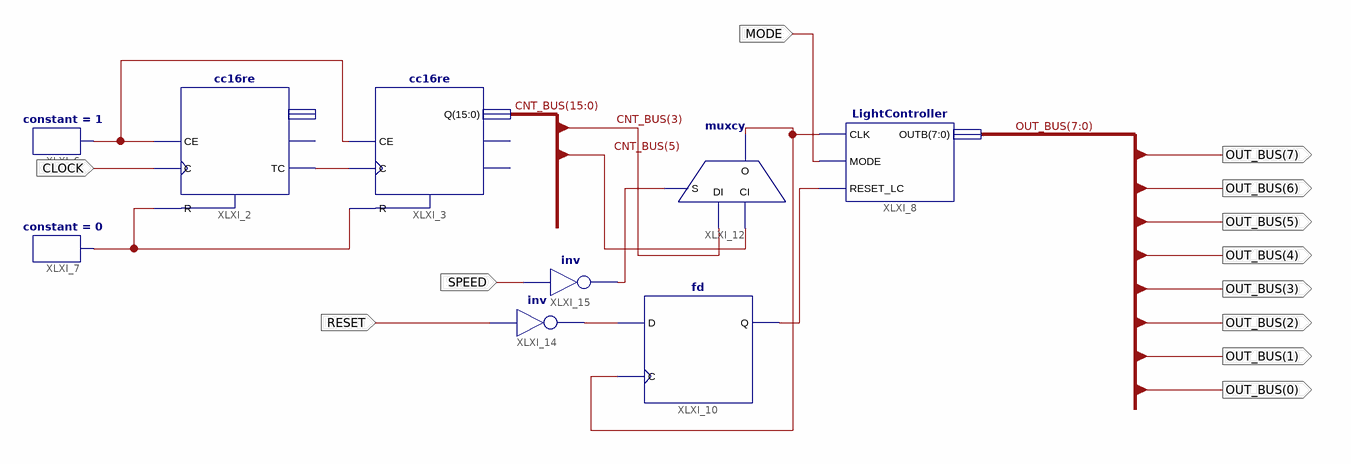
[diagram p0: schematic sheet 1]
// Xilinx ISE schematic TopLevel.sch (spartan3a) as structural Verilog: 9 symbols, 12 ports
module TopLevel (
  input  CLOCK,
  input  MODE,
  input  RESET,
  input  SPEED,
  output [7:0] OUT_BUS
);

  wire XLXN_1, XLXN_5, XLXN_12, XLXN_18, XLXN_19, XLXN_27, XLXN_30;
  wire [15:0] CNT_BUS;

  constant #(.CValue("1")) XLXI_6 (.O(XLXN_12));
  constant #(.CValue("0")) XLXI_7 (.O(XLXN_5));
  LightController XLXI_8 (.CLK(XLXN_19), .OUTB(OUT_BUS), .MODE(MODE), .RESET_LC(XLXN_18));
  fd XLXI_10 (.C(XLXN_19), .D(XLXN_27), .Q(XLXN_18));
  muxcy XLXI_12 (.CI(CNT_BUS[5]), .DI(CNT_BUS[3]), .S(XLXN_30), .O(XLXN_19));
  cc16re XLXI_2 (.C(CLOCK), .CE(XLXN_12), .R(XLXN_5), .TC(XLXN_1));  // open: CEO, Q
  cc16re XLXI_3 (.C(XLXN_1), .CE(XLXN_12), .R(XLXN_5), .Q(CNT_BUS));  // open: CEO, TC
  not XLXI_14 (XLXN_27, RESET);
  not XLXI_15 (XLXN_30, SPEED);
endmodule
